# EasyEDA Pro project STM32F767_F429_H743底板原理图_PCB.eprj, schematic 原理图1

## Sheets
1 原理图1
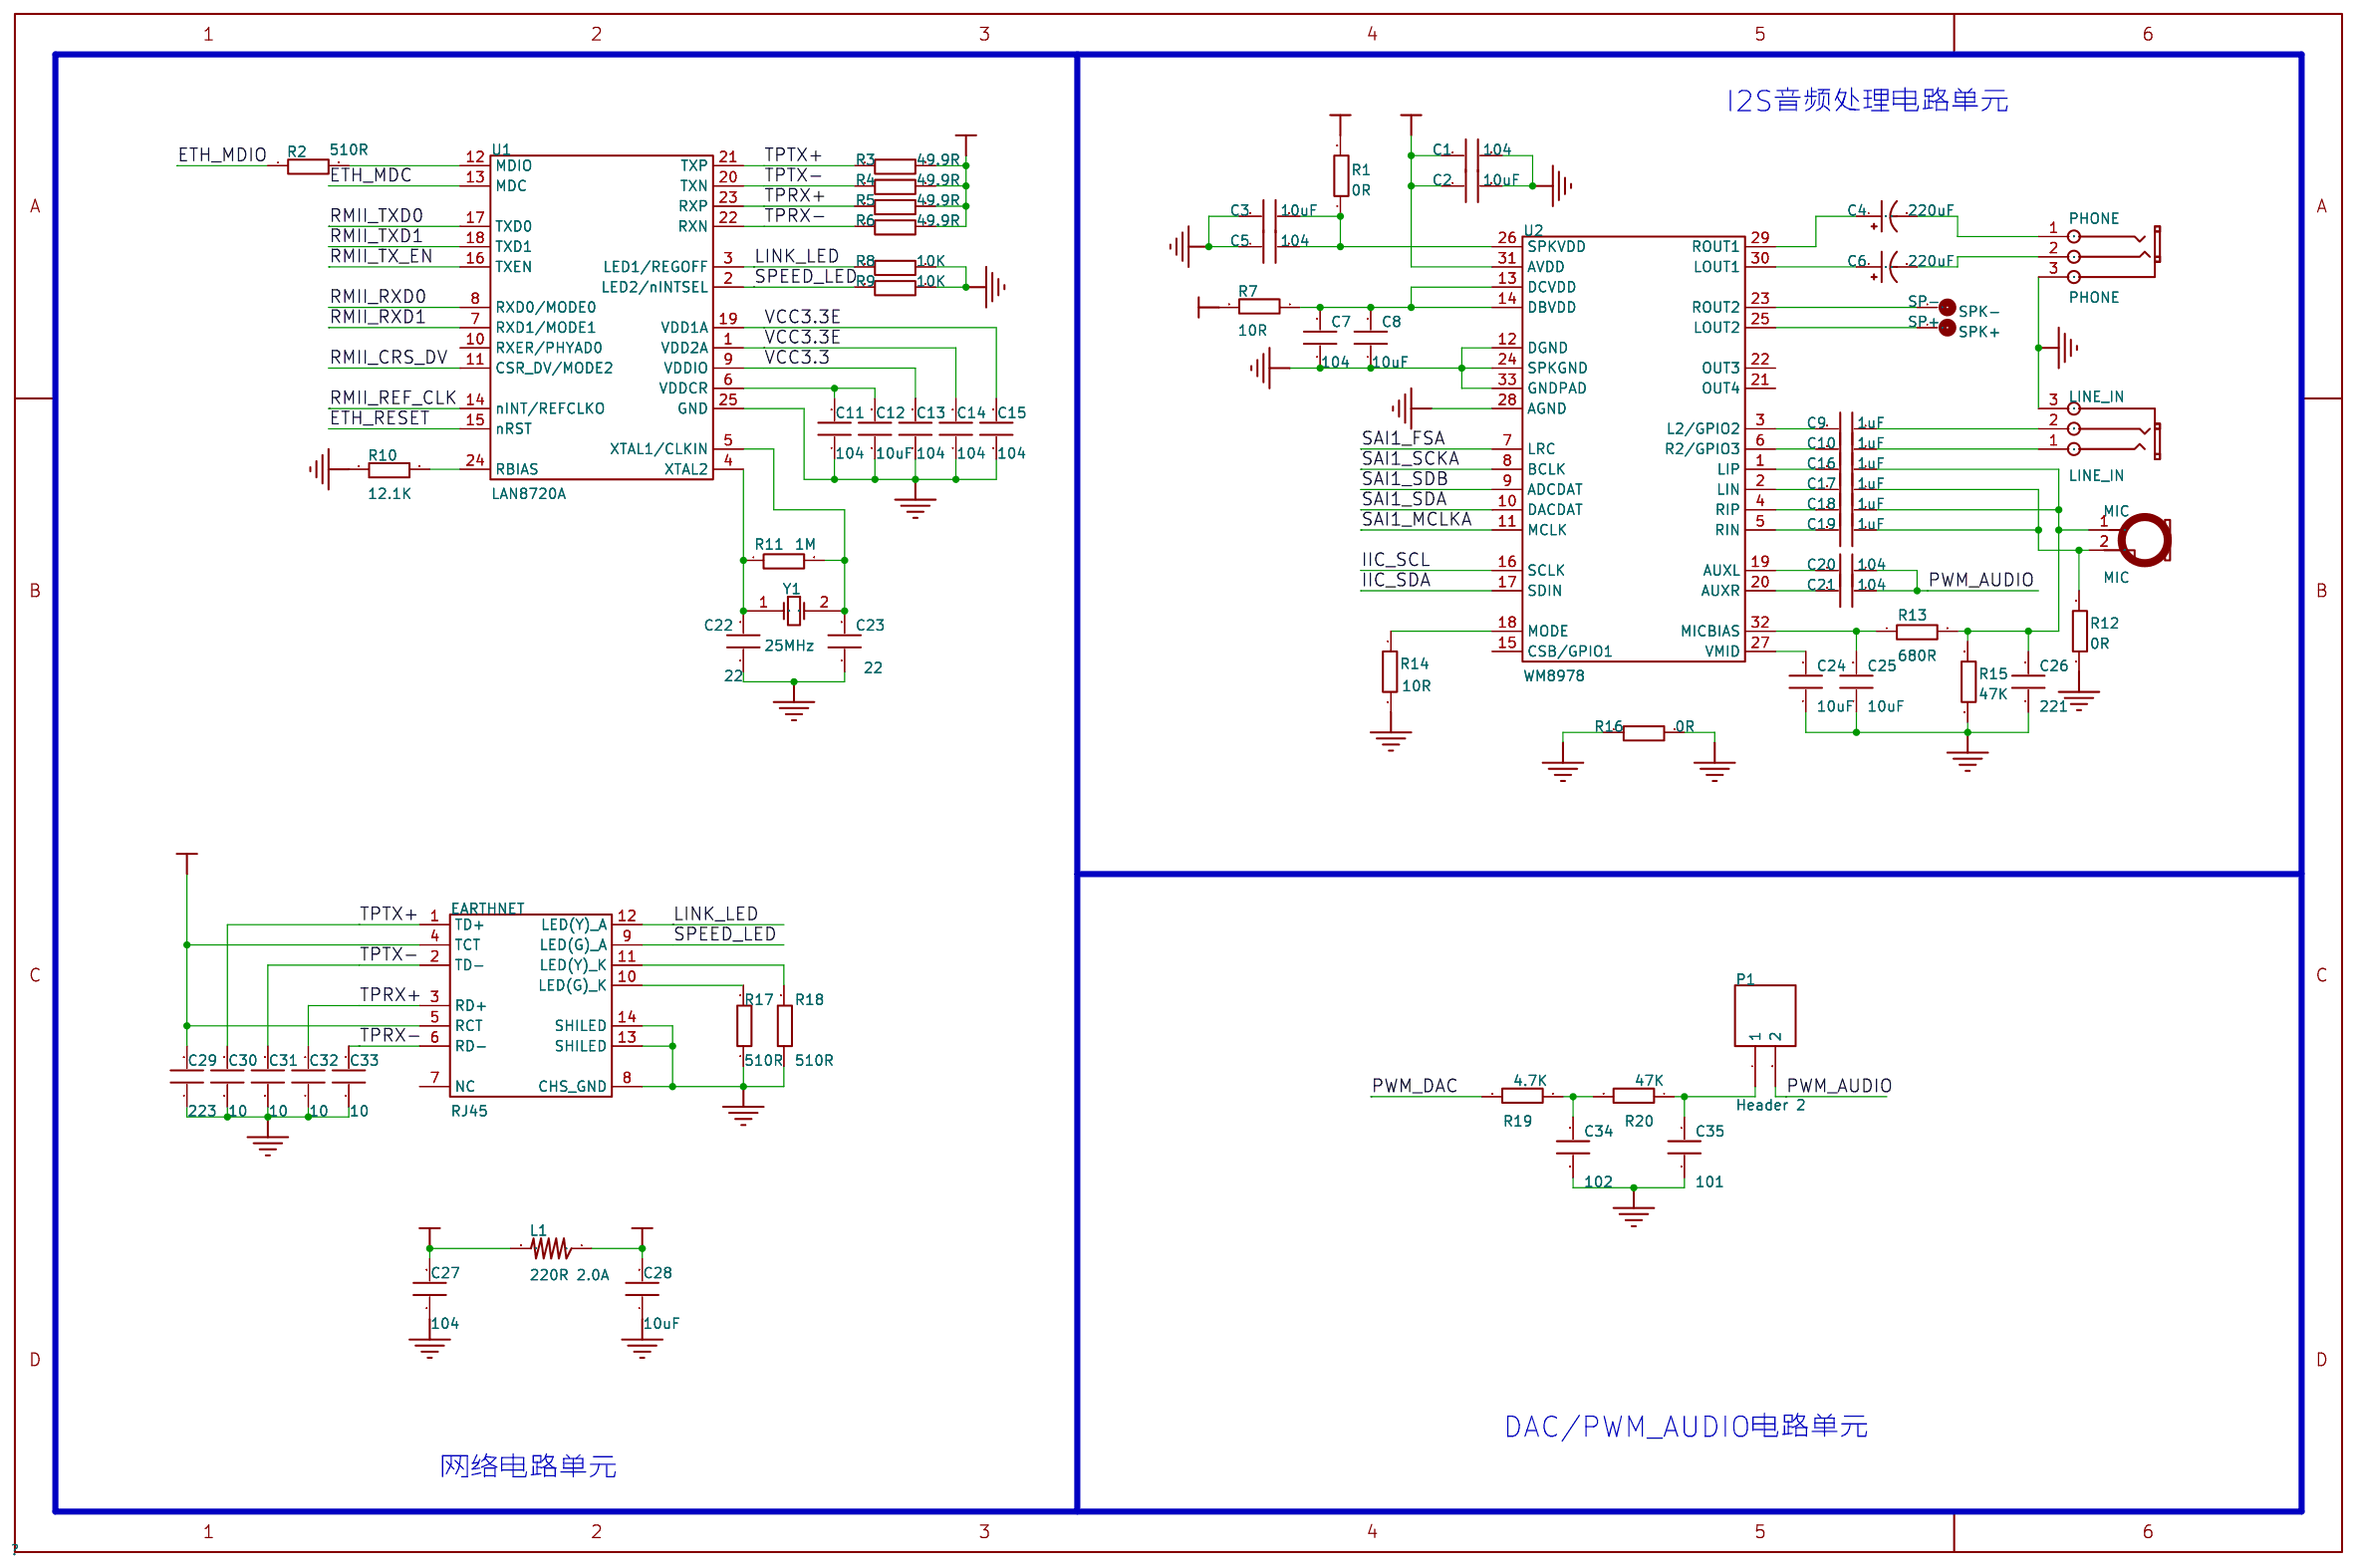
[diagram p0: 原理图1]
2 原理图2
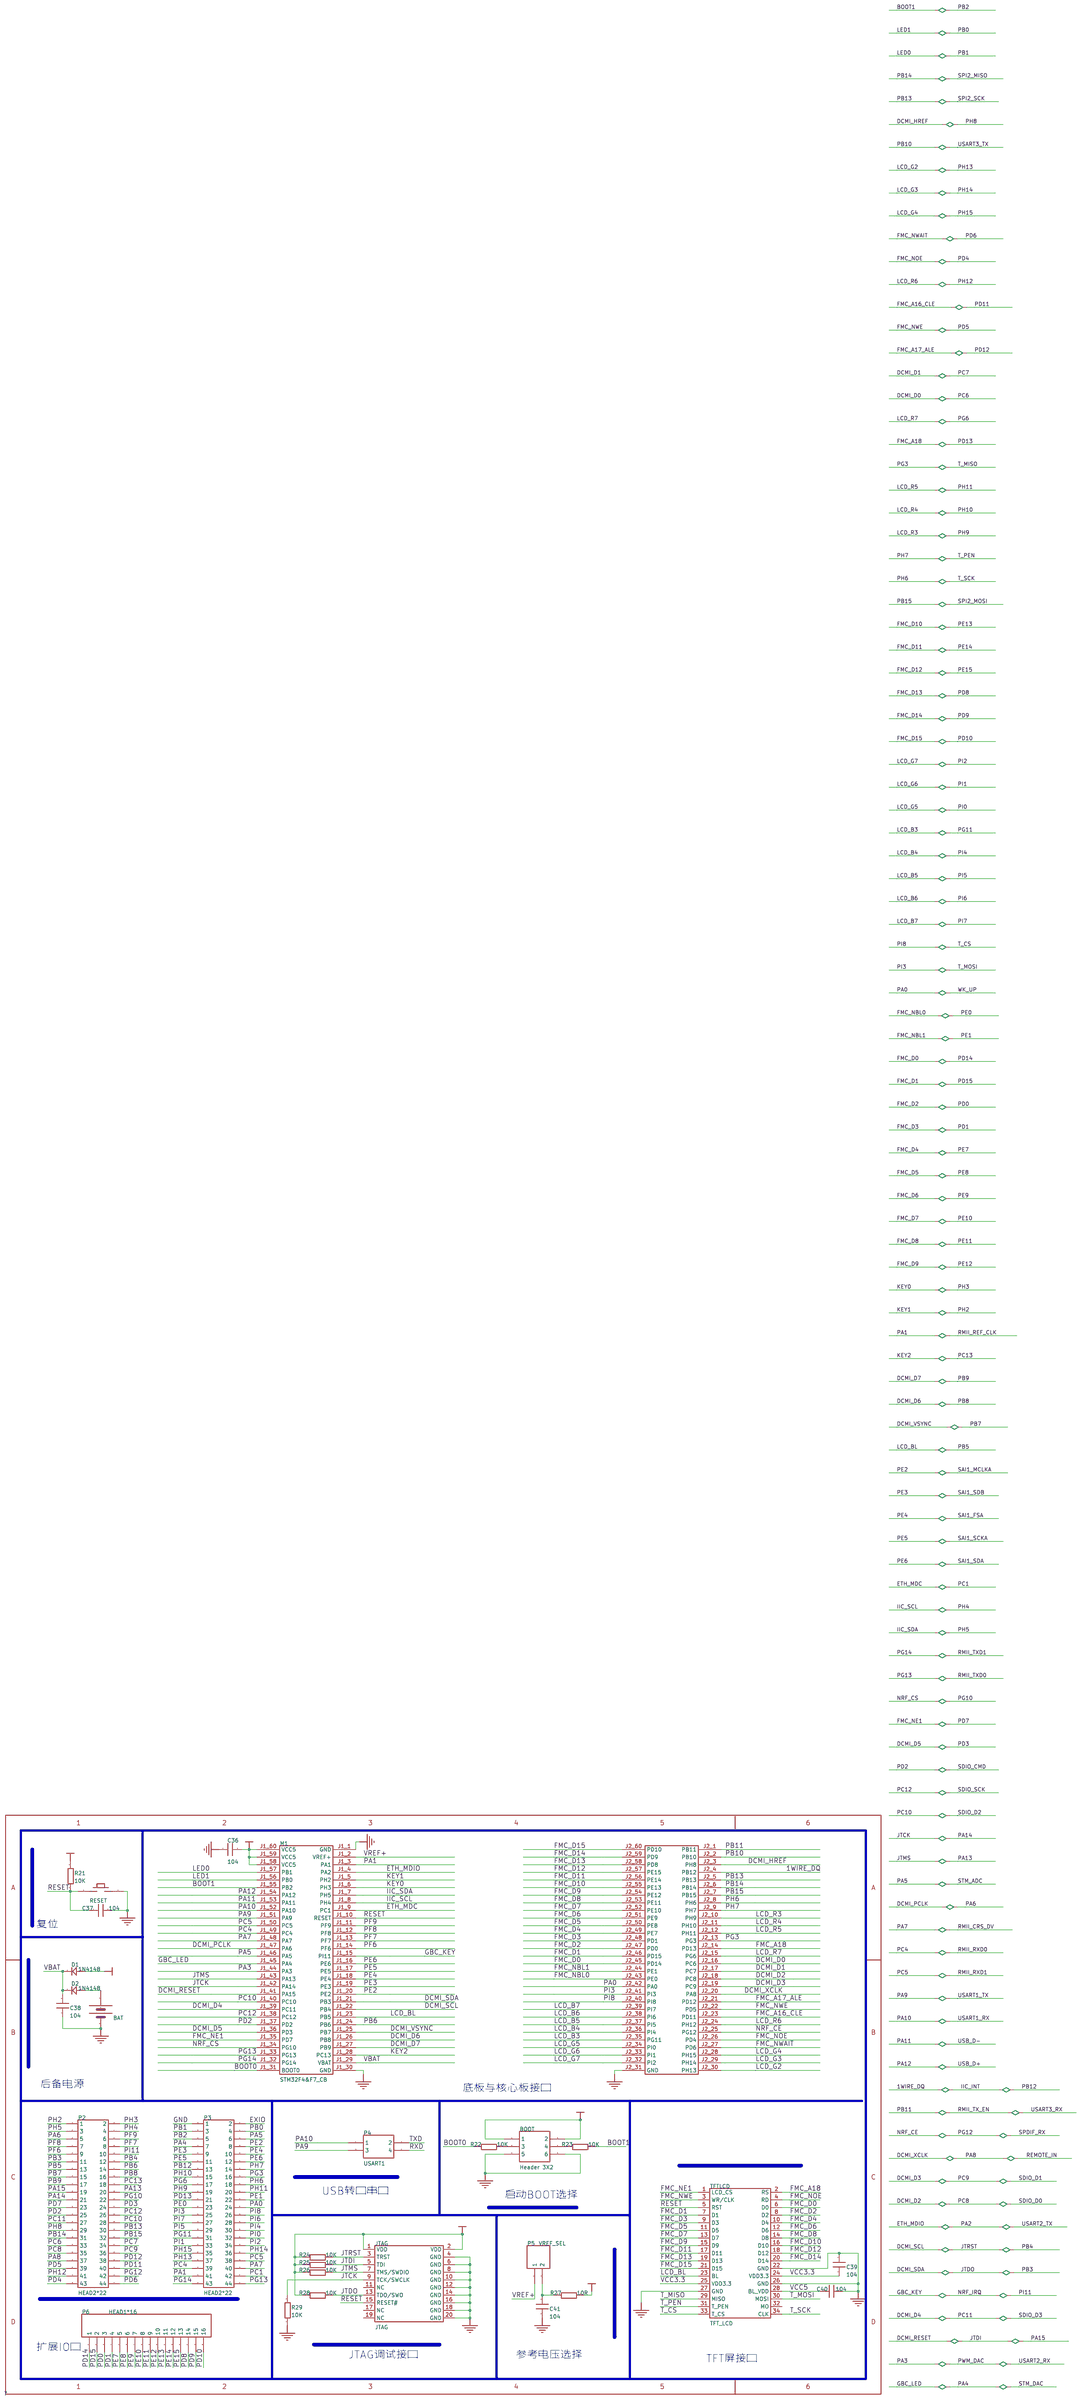
[diagram p1: 原理图2]
3 原理图3
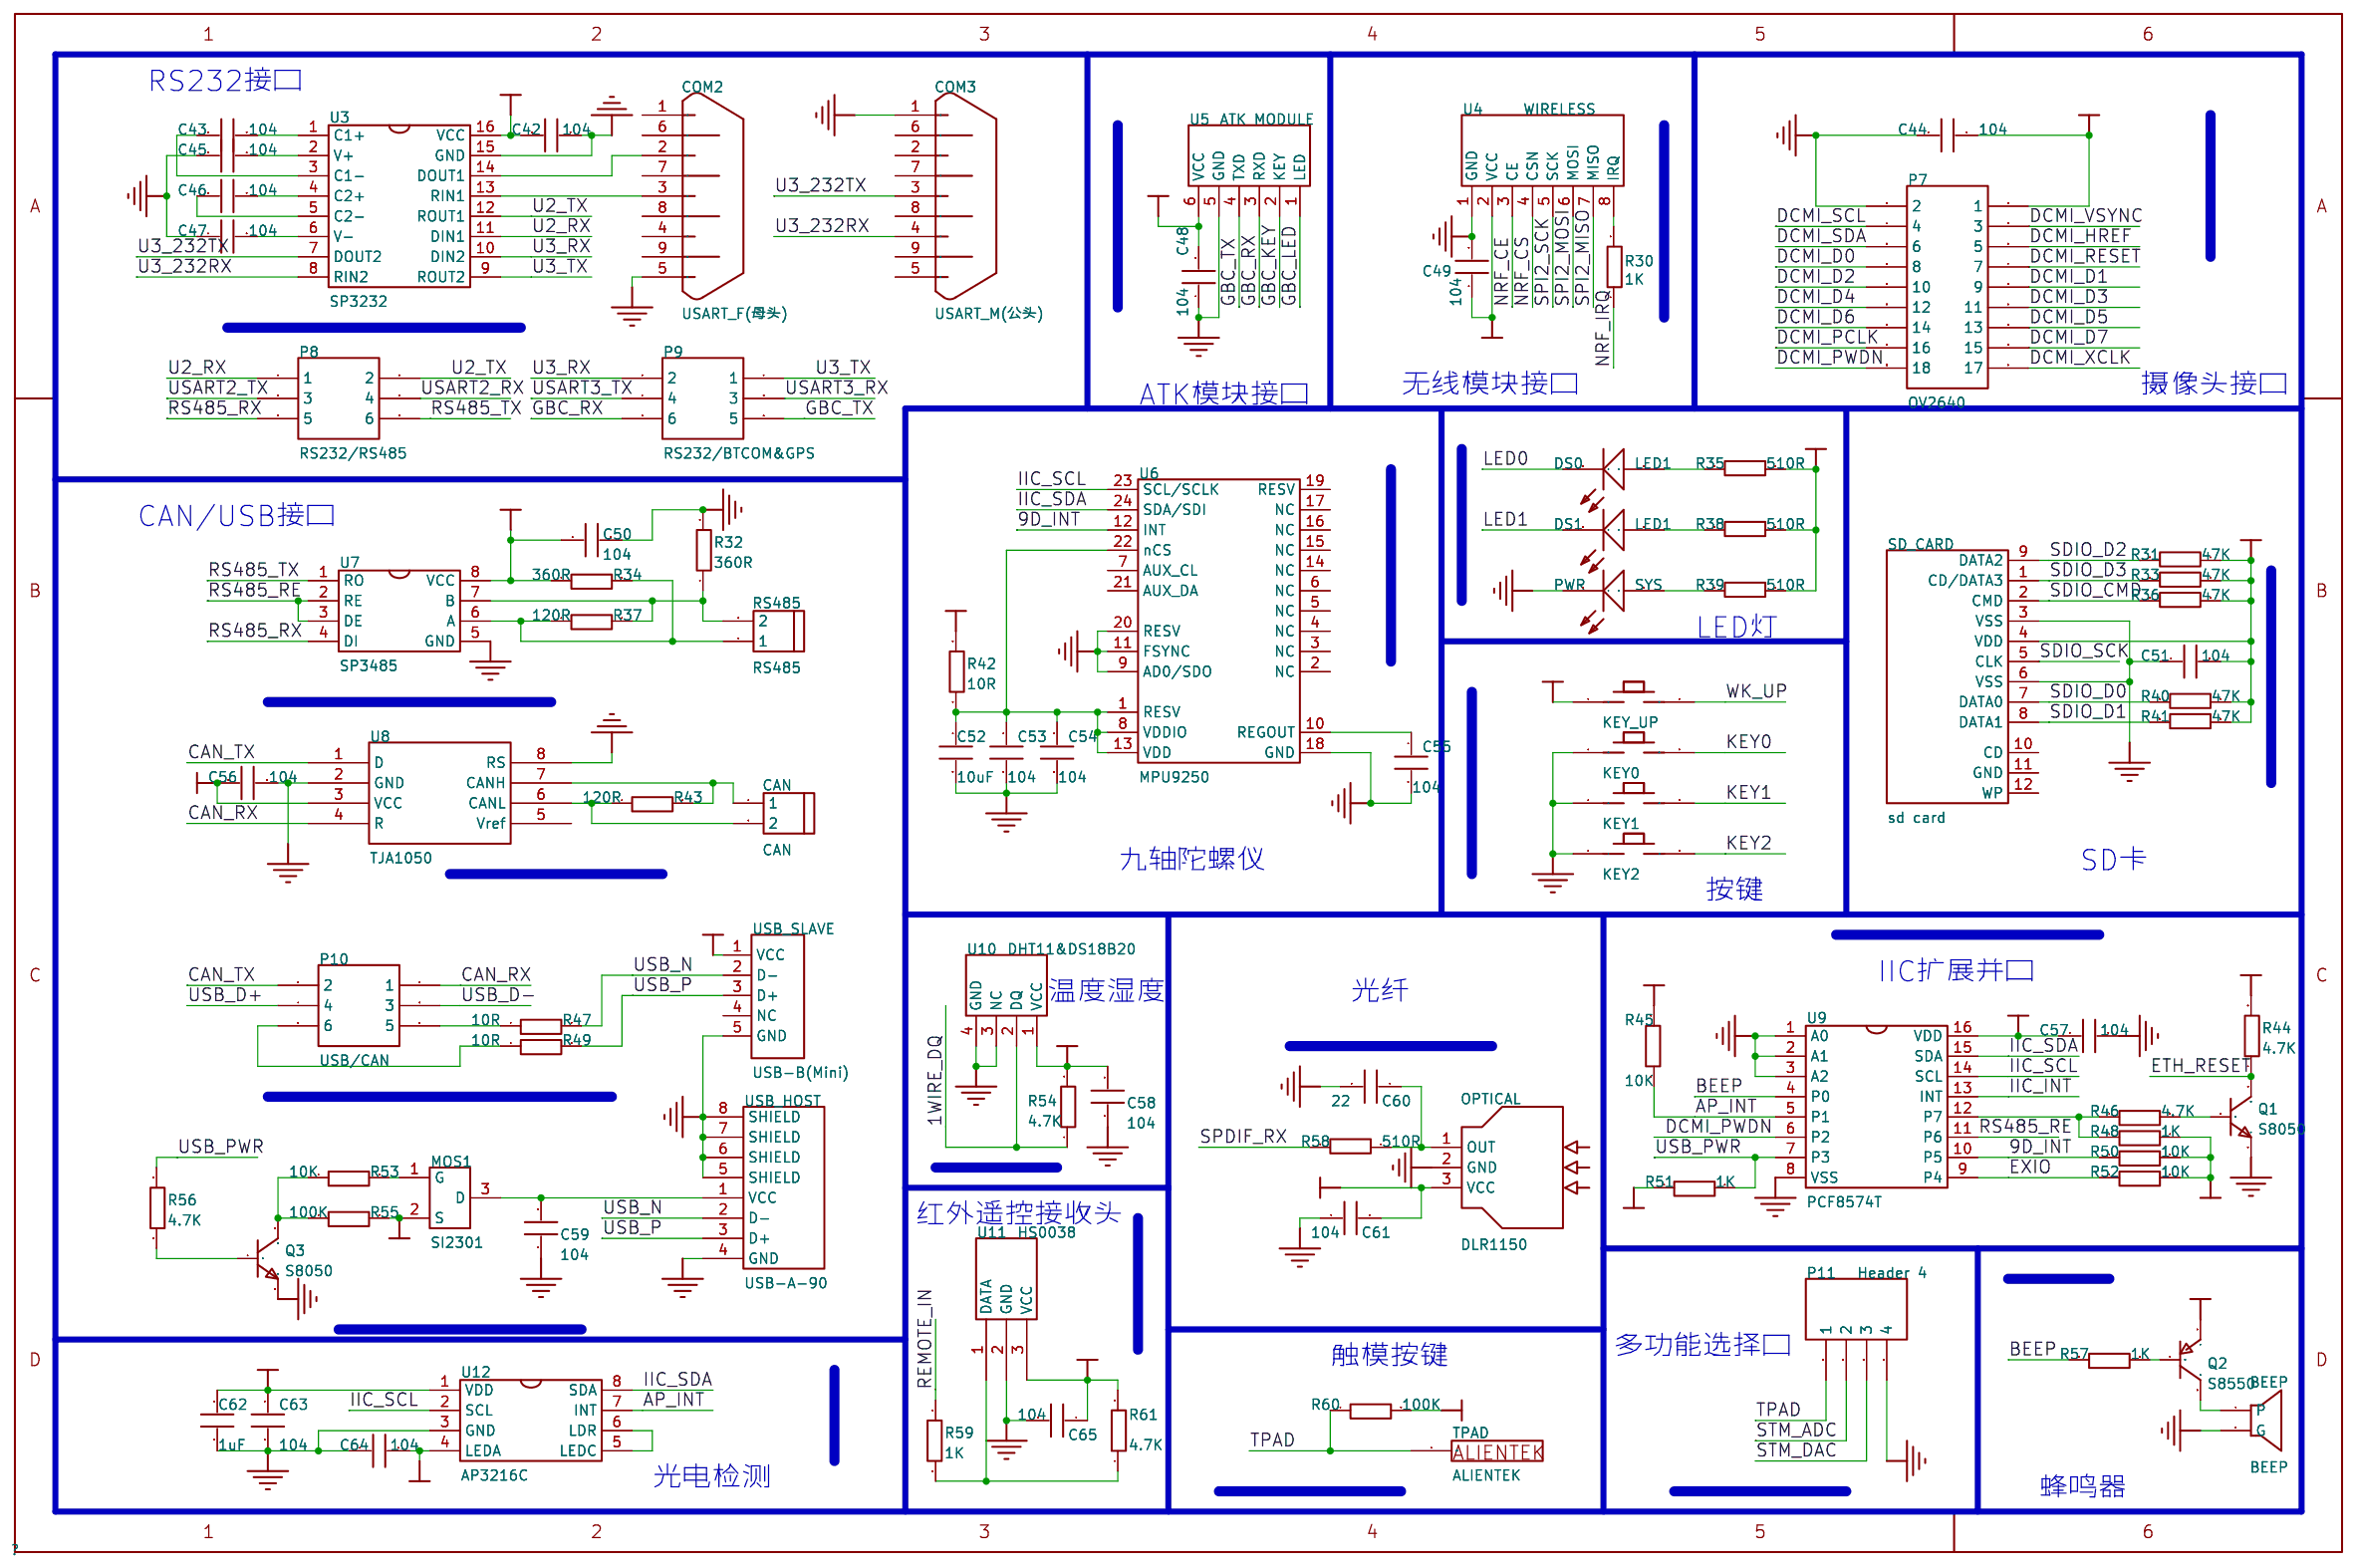
[diagram p2: 原理图3]
4 原理图4
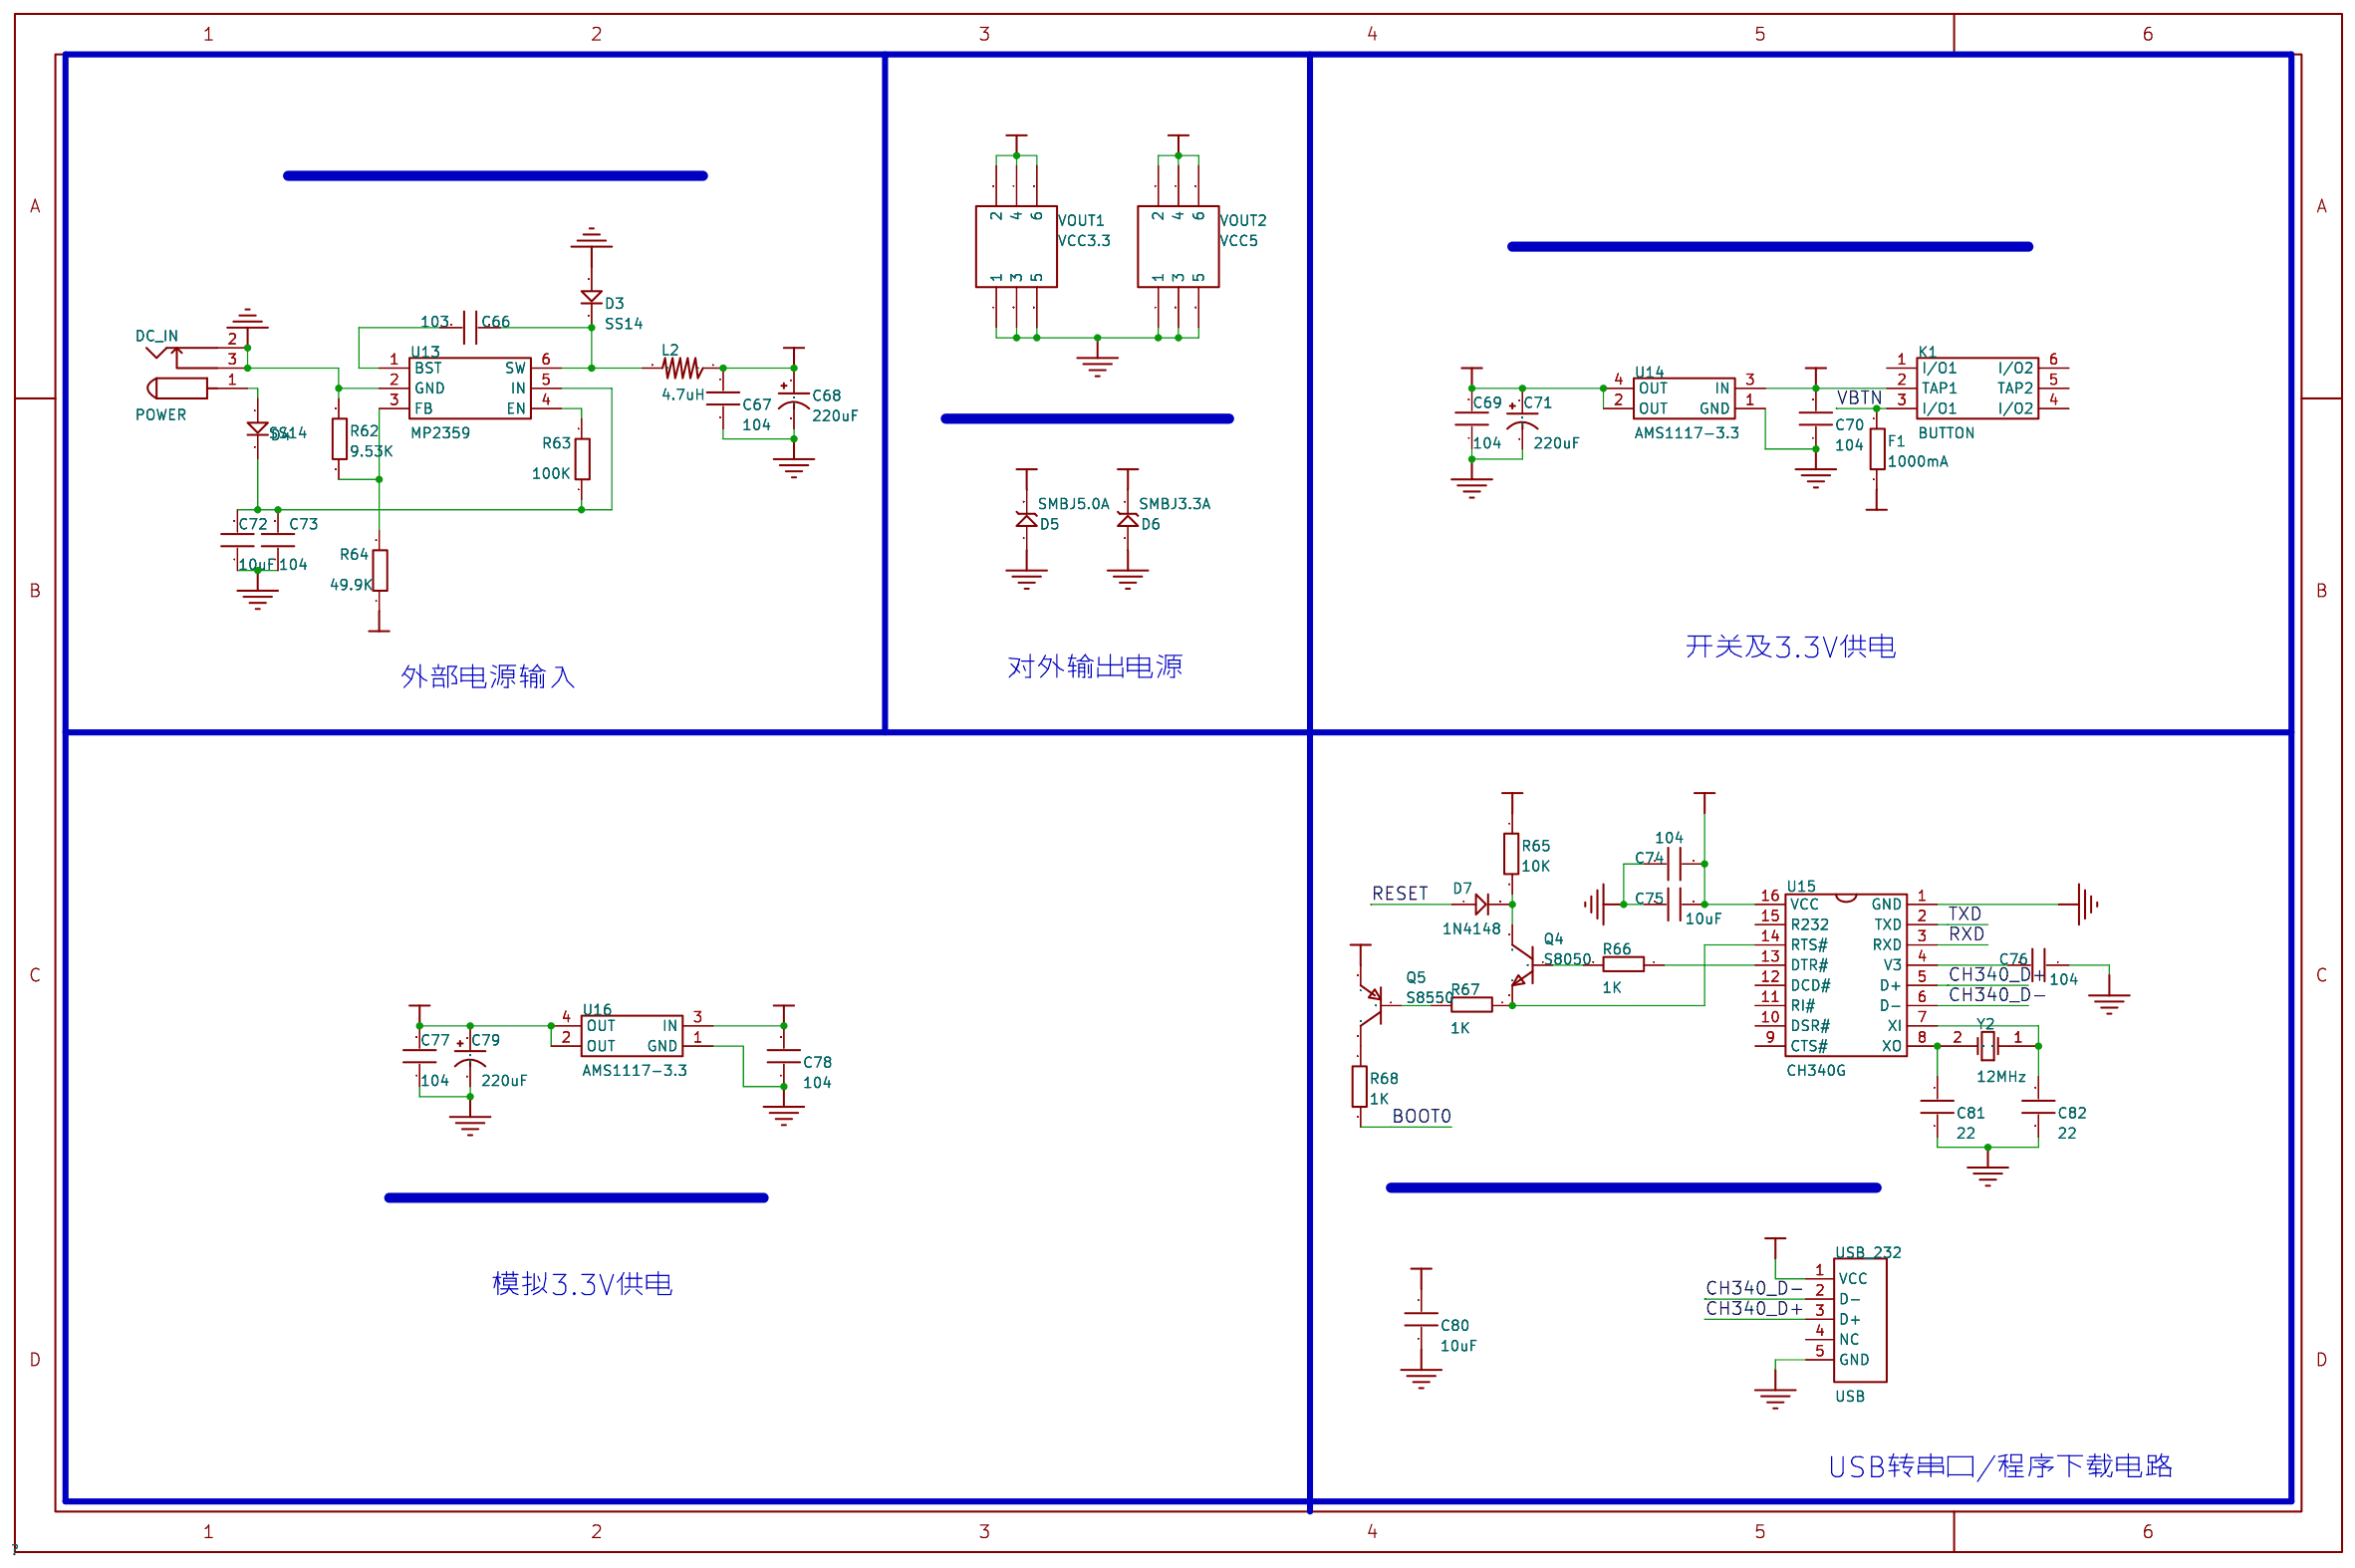
[diagram p3: 原理图4]

## Parts
sheet 原理图1
C1  104  [C 0603]
C2  10uF  [0805]
C3  10uF  [0805]
C4  220uF  [CM D(6.3*7.7)]
C5  104  [C 0603]
C6  220uF  [CM D(6.3*7.7)]
C7  104  [C 0603]
C8  10uF  [0805]
C9  1uF  [C 0603]
C10  1uF  [C 0603]
C11  104  [C 0603]
C12  10uF  [0805]
C13  104  [C 0603]
C14  104  [C 0603]
C15  104  [C 0603]
C16  1uF  [C 0603]
C17  1uF  [C 0603]
C18  1uF  [C 0603]
C19  1uF  [C 0603]
C20  104  [C 0603]
C21  104  [C 0603]
C22  22  [C 0603]
C23  22  [C 0603]
C24  10uF  [0805]
C25  10uF  [0805]
C26  221  [C 0603]
C27  104  [C 0603]
C28  10uF  [0805]
C29  223  [C 0603]
C30  10  [C 0603]
C31  10  [C 0603]
C32  10  [C 0603]
C33  10  [C 0603]
C34  102  [C 0603]
C35  101  [C 0603]
EARTHNET  RJ45  [HR911105A]
L1  220R 2.0A  [L 0603]
LINE_IN  LINE_IN  [PJ-313]
MIC  MIC  [MIC-6022]
P1  Header 2  [HDR1X2]
PHONE  PHONE  [PJ-313]
R1  0R  [R 0603]
R2  510R  [R 0603]
R3  49.9R  [R 0603]
R4  49.9R  [R 0603]
R5  49.9R  [R 0603]
R6  49.9R  [R 0603]
R7  10R  [R 0603]
R8  10K  [R 0603]
R9  10K  [R 0603]
R10  12.1K  [R 0603]
R11  1M  [R 0603]
R12  0R  [R 0603]
R13  680R  [R 0603]
R14  10R  [R 0603]
R15  47K  [R 0603]
R16  0R  [R 0603]
R17  510R  [R 0603]
R18  510R  [R 0603]
R19  4.7K  [R 0603]
R20  47K  [R 0603]
SP+  SPK+  [TP-1.5]
SP-  SPK-  [TP-1.5]
U1  LAN8720A  [QFN24]
U2  WM8978  [QFN32_G]
Y1  25MHz  [OSC HC-49S]
sheet 原理图2
BAT  BATT  [BATM]
BOOT  Header 3X2  [HDR2X3]
C36  104  [C 0603]
C37  104  [C 0603]
C38  104  [C 0603]
C39  104  [C 0603]
C40  104  [C 0603]
C41  104  [C 0603]
D1  1N4148  [DIODE_SOP]
D2  1N4148  [DIODE_SOP]
JTAG  JTAG  [JTAG_20]
M1  STM32F4&F7_CB  [STM32F4&F7_CB]
P2  HEAD2*22  [HDR2.54-LI-2x22P]
P3  HEAD2*22  [HDR2.54-LI-2x22P]
P4  USART1  [HDR2X2]
P5  VREF_SEL  [HDR1X2]
P6  HEAD1*16  [HDR1X16]
R21  10K  [R 0603]
R22  10K  [R 0603]
R23  10K  [R 0603]
R24  10K  [R 0603]
R25  10K  [R 0603]
R26  10K  [R 0603]
R27  10R  [R 0603]
R28  10K  [R 0603]
R29  10K  [R 0603]
RESET  KEY_M  [KEY_M]
TFTLCD  TFT_LCD  [DB2*17-4.3]
sheet 原理图3
BEEP  BEEP  [BELL-5]
C42  104  [C 0603]
C43  104  [C 0603]
C44  104  [C 0603]
C45  104  [C 0603]
C46  104  [C 0603]
C47  104  [C 0603]
C48  104  [C 0603]
C49  104  [C 0603]
C50  104  [C 0603]
C51  104  [C 0603]
C52  10uF  [0805]
C53  104  [C 0603]
C54  104  [C 0603]
C55  104  [C 0603]
C56  104  [C 0603]
C57  104  [C 0603]
C58  104  [C 0603]
C59  104  [C 0603]
C60  22  [C 0603]
C61  104  [C 0603]
C62  1uF  [C 0603]
C63  104  [C 0603]
C64  104  [C 0603]
C65  104  [C 0603]
CAN  CAN  [KF301-5.0-2P]
COM2  USART_F(母头)  [DB9]
COM3  USART_M(公头)  [DB9]
DS0  LED1  [SMDLED]
DS1  LED1  [SMDLED]
KEY0  KEY_M  [KEY_M]
KEY1  KEY_M  [KEY_M]
KEY2  KEY_M  [KEY_M]
KEY_UP  KEY_M  [KEY_M]
MOS1  SI2301  [SOT-23A]
OPTICAL  DLR1150  [DLR-1150 / 2150]
P7  OV2640  [HDR2X9]
P8  RS232/RS485  [HDR2X3]
P9  RS232/BTCOM&GPS  [HDR2X3]
P10  USB/CAN  [HDR2X3]
P11  Header 4  [HDR1X4]
PWR  SYS  [SMDLED]
Q1  S8050  [SOT-23A]
Q2  S8550  [SOT-23A]
Q3  S8050  [SOT-23A]
R30  1K  [R 0603]
R31  47K  [R 0603]
R32  360R  [R 0603]
R33  47K  [R 0603]
R34  360R  [R 0603]
R35  510R  [R 0603]
R36  47K  [R 0603]
R37  120R  [R 0603]
R38  510R  [R 0603]
R39  510R  [R 0603]
R40  47K  [R 0603]
R41  47K  [R 0603]
R42  10R  [R 0603]
R43  120R  [R 0603]
R44  4.7K  [R 0603]
R45  10K  [R 0603]
R46  4.7K  [R 0603]
R47  10R  [R 0603]
R48  1K  [R 0603]
R49  10R  [R 0603]
R50  10K  [R 0603]
R51  1K  [R 0603]
R52  10K  [R 0603]
R53  10K  [R 0603]
R54  4.7K  [R 0603]
R55  100K  [R 0603]
R56  4.7K  [R 0603]
R57  1K  [R 0603]
R58  510R  [R 0603]
R59  1K  [R 0603]
R60  100K  [R 0603]
R61  4.7K  [R 0603]
RS485  RS485  [KF301-5.0-2P]
SD_CARD  sd card  [SDCARD_L]
TPAD  ALIENTEK  [ALIENTEK_PAD1]
U3  SP3232  [SOP16M]
U4  WIRELESS  [NRF24L01]
U5  ATK MODULE  [HEAD6]
U6  MPU9250  [QFN24-T]
U7  SP3485  [SOP-8]
U8  TJA1050  [SOP-8]
U9  PCF8574T  [SO-16]
U10  DHT11&DS18B20  [DHT11]
U11  HS0038  [VS1838B-A]
U12  AP3216C  [AP3216C]
USB_HOST  USB-A-90  [USB-A-90]
USB_SLAVE  USB-B(Mini)  [USB/SM0.8-6H5]
sheet 原理图4
C66  103  [C 0603]
C67  104  [C 0603]
C68  220uF  [CM D(6.3*7.7)]
C69  104  [C 0603]
C70  104  [C 0603]
C71  220uF  [CM D(6.3*7.7)]
C72  10uF  [0805]
C73  104  [C 0603]
C74  104  [C 0603]
C75  10uF  [0805]
C76  104  [C 0603]
C77  104  [C 0603]
C78  104  [C 0603]
C79  220uF  [CM D(6.3*7.7)]
C80  10uF  [0805]
C81  22  [C 0603]
C82  22  [C 0603]
D3  SS14  [DO-214AC]
D4  SS14  [DO-214AC]
D5  SMBJ5.0A  [SMBJ]
D6  SMBJ3.3A  [SMBJ]
D7  1N4148  [DIODE_SOP]
DC_IN  POWER  [DC-005]
F1  1000mA  [FU 1206]
K1  BUTTON  [KFT DIP-8.5*8.5]
L2  4.7uH  [CDRH73]
Q4  S8050  [SOT-23A]
Q5  S8550  [SOT-23A]
R62  9.53K  [R 0603]
R63  100K  [R 0603]
R64  49.9K  [R 0603]
R65  10K  [R 0603]
R66  1K  [R 0603]
R67  1K  [R 0603]
R68  1K  [R 0603]
U13  MP2359  [SOT-23-6]
U14  AMS1117-3.3  [SOT223_N_A]
U15  CH340G  [SOP16M]
U16  AMS1117-3.3  [SOT223_N_A]
USB_232  USB  [USB/SM0.8-6H5]
VOUT1  VCC3.3  [HDR2X3]
VOUT2  VCC5  [HDR2X3]
Y2  12MHz  [OSC HC-49S]

## Library data of the parts
C1 C5 C7 C11 C13-C15 C20 C21 C27 C36-C51 C53-C59 C61 C63-C65 C67 C69 C70 C73 C74 C76-C78 = 104: Design Item ID: C; Library Name: STM32F429_F746
C2 C3 C8 C12 C24 C25 C28 C52 C72 C75 C80 = 10uF: Design Item ID: C; Library Name: STM32F429_F746
C4 C6 C68 C71 C79 = 220uF: Design Item ID: CAP; Library Name: STM32F429_F746
C9 C10 C16-C19 C62 = 1uF: Design Item ID: C; Library Name: STM32F429_F746
C22 C23 C60 C81 C82 = 22: Design Item ID: C; Library Name: STM32F429_F746
C26 = 221: Design Item ID: C; Library Name: STM32F429_F746
C29 = 223: Design Item ID: C; Library Name: STM32F429_F746
C30-C33 = 10: Design Item ID: C; Library Name: STM32F429_F746
C34 = 102: Design Item ID: C; Library Name: STM32F429_F746
C35 = 101: Design Item ID: C; Library Name: STM32F429_F746
EARTHNET = RJ45: Design Item ID: HR911105; Library Name: STM32F429_F746
L1 = 220R 2.0A: Design Item ID: L_SOP; Library Name: STM32F429_F746
LINE_IN = LINE_IN: Design Item ID: PHONE_M; Library Name: STM32F429_F746
MIC = MIC: Library Name: STM32F429_F746
P1 = Header 2: Header, 2-Pin; LatestRevisionDate: 17-Jul-2002; LatestRevisionNote: Re-released for DXP Platform.; Publisher: Altium Limited; Library Name: STM32F429_F746
PHONE = PHONE: Design Item ID: PHONE_M; Library Name: STM32F429_F746
R1 R12 R16 = 0R: Design Item ID: R; Library Name: STM32F429_F746
R2 R17 R18 R35 R38 R39 R58 = 510R: Design Item ID: R; Library Name: STM32F429_F746
R3-R6 = 49.9R: Design Item ID: R; Library Name: STM32F429_F746
R7 R14 R27 R42 R47 R49 = 10R: Design Item ID: R; Library Name: STM32F429_F746
R8 R9 R21-R26 R28 R29 R45 R50 R52 R53 R65 = 10K: Design Item ID: R; Library Name: STM32F429_F746
R10 = 12.1K: Design Item ID: R; Library Name: STM32F429_F746
R11 = 1M: Design Item ID: R; Library Name: STM32F429_F746
R13 = 680R: Design Item ID: R; Library Name: STM32F429_F746
R15 R20 R31 R33 R36 R40 R41 = 47K: Design Item ID: R; Library Name: STM32F429_F746
R19 R44 R46 R54 R56 R61 = 4.7K: Design Item ID: R; Library Name: STM32F429_F746
SP+ = SPK+: 测试点; Design Item ID: TEST-POINT; Library Name: STM32F429_F746
SP- = SPK-: 测试点; Design Item ID: TEST-POINT; Library Name: STM32F429_F746
U1 = LAN8720A: ETH PHY; Design Item ID: LAN8720; Library Name: STM32F429_F746
U2 = WM8978: 24bit ADC&DAC; Library Name: STM32F429_F746
Y1 = 25MHz: Crystal Oscillator; Published: 8-Jun-2000; LatestRevisionDate: 17-Jul-2002; LatestRevisionNote: Re-released for DXP Platform.; Publisher: Altium Limited; Design Item ID: XTAL; Library Name: STM32F429_F746
BAT = BATT: Library Name: STM32F429_F746
BOOT = Header 3X2: Header, 3-Pin, Dual row; LatestRevisionDate: 17-Jul-2002; LatestRevisionNote: Re-released for DXP Platform.; Publisher: Altium Limited; Library Name: STM32F429_F746
D1 D2 D7 = 1N4148: Design Item ID: D; Library Name: STM32F429_F746
JTAG = JTAG: Library Name: STM32F429_F746
M1 = STM32F4&F7_CB: F429/746 Core Board; Library Name: STM32F429_F746
P2 P3 = HEAD2*22: Library Name: STM32F429_F746
P4 = USART1: Header, 2-Pin, Dual row; LatestRevisionDate: 17-Jul-2002; LatestRevisionNote: Re-released for DXP Platform.; Publisher: Altium Limited; Design Item ID: Header 2X2; Library Name: STM32F429_F746
P5 = VREF_SEL: Header, 2-Pin; LatestRevisionDate: 17-Jul-2002; LatestRevisionNote: Re-released for DXP Platform.; Publisher: Altium Limited; Design Item ID: Header 2; Library Name: STM32F429_F746
P6 = HEAD1*16: Header, 16-Pin; LatestRevisionDate: 17-Jul-2002; LatestRevisionNote: Re-released for DXP Platform.; Publisher: Altium Limited; Design Item ID: Header 16; Library Name: STM32F429_F746
KEY0-KEY2 KEY_UP RESET = KEY_M: Library Name: STM32F429_F746
TFTLCD = TFT_LCD: Library Name: STM32F429_F746
BEEP = BEEP: Library Name: STM32F429_F746
CAN = CAN: Design Item ID: HEAD2; Library Name: STM32F429_F746
COM2 = USART_F(母头): Library Name: STM32F429_F746
COM3 = USART_M(公头): Library Name: STM32F429_F746
DS0 DS1 = LED1: Typical RED, GREEN, YELLOW, AMBER GaAs LED; Published: 8-Jun-2000; LatestRevisionDate: 17-Jul-2002; LatestRevisionNote: Re-released for DXP Platform.; PackageDocument: Feb-2002; PackageReference: 3.2X1.6X1.1; Publisher: Altium Limited; Design Item ID: LED2; Library Name: STM32F429_F746
MOS1 = SI2301: IRLML6401/SI2301; Design Item ID: MOS-P; Library Name: STM32F429_F746
OPTICAL = DLR1150: 音频光纤接收座; Design Item ID: DLR 1150/2150; Library Name: STM32F429_F746
P7 = OV2640: Header, 9-Pin, Dual row; LatestRevisionDate: 17-Jul-2002; LatestRevisionNote: Re-released for DXP Platform.; Publisher: Altium Limited; Design Item ID: Header 9X2; Library Name: STM32F429_F746
P8 = RS232/RS485: Header, 3-Pin, Dual row; LatestRevisionDate: 17-Jul-2002; LatestRevisionNote: Re-released for DXP Platform.; Publisher: Altium Limited; Design Item ID: Header 3X2; Library Name: STM32F429_F746
P9 = RS232/BTCOM&GPS: Header, 3-Pin, Dual row; LatestRevisionDate: 17-Jul-2002; LatestRevisionNote: Re-released for DXP Platform.; Publisher: Altium Limited; Design Item ID: Header 3X2; Library Name: STM32F429_F746
P10 = USB/CAN: Header, 3-Pin, Dual row; LatestRevisionDate: 17-Jul-2002; LatestRevisionNote: Re-released for DXP Platform.; Publisher: Altium Limited; Design Item ID: Header 3X2; Library Name: STM32F429_F746
P11 = Header 4: Header, 4-Pin; LatestRevisionDate: 17-Jul-2002; LatestRevisionNote: Re-released for DXP Platform.; Publisher: Altium Limited; Library Name: STM32F429_F746
PWR = SYS: Typical RED, GREEN, YELLOW, AMBER GaAs LED; Published: 8-Jun-2000; LatestRevisionDate: 17-Jul-2002; LatestRevisionNote: Re-released for DXP Platform.; PackageDocument: Feb-2002; PackageReference: 3.2X1.6X1.1; Publisher: Altium Limited; Design Item ID: LED2; Library Name: STM32F429_F746
Q1 Q3 Q4 = S8050: NPN Bipolar Transistor; Published: 8-Jun-2000; LatestRevisionDate: 17-Jul-2002; LatestRevisionNote: Re-released for DXP Platform.; PackageReference: TO-226-AA; Publisher: Altium Limited; PackageDescription: TO, Flat Index; 3 In-Line, Axial Leads; Body Dia. 4.8mm; Leads 0.55 x 0.51 mm (max); Code_JEDEC: TO-226-AA; Design Item ID: NPN; Library Name: Miscellaneous Devices
Q2 Q5 = S8550: PNP Bipolar Transistor; Published: *; LatestRevisionDate: *; LatestRevisionNote: *; PackageReference: *; Publisher: *; Code_JEDEC: *; Design Item ID: PNP; Library Name: dam_1
R30 R48 R51 R57 R59 R66-R68 = 1K: Design Item ID: R; Library Name: STM32F429_F746
R32 R34 = 360R: Design Item ID: R; Library Name: STM32F429_F746
R37 R43 = 120R: Design Item ID: R; Library Name: STM32F429_F746
R55 R60 R63 = 100K: Design Item ID: R; Library Name: STM32F429_F746
RS485 = RS485: Design Item ID: HEAD2; Library Name: STM32F429_F746
SD_CARD = sd card: Origin Footprint 2: SDCARD_S; Library Name: STM32F429_F746
TPAD = ALIENTEK: ALIENTEK TPAD; Library Name: STM32F429_F746
U3 = SP3232: Design Item ID: MAX3232; Library Name: STM32F429_F746
U4 = WIRELESS: Library Name: STM32F429_F746
U5 = ATK MODULE: ATK-HC05; Design Item ID: ATK-HC05; Library Name: STM32F429_F746
U6 = MPU9250: 9轴运动处理传感器; Library Name: STM32F429_F746
U7 = SP3485: Design Item ID: MAX3485; Library Name: STM32F429_F746
U8 = TJA1050: Design Item ID: SN65HVD230D; Library Name: STM32F429_F746
U9 = PCF8574T: 8路IO扩展,IIC接口; Library Name: STM32F429_F746
U10 = DHT11&DS18B20: 数字温湿度传感器; Library Name: STM32F429_F746
U11 = HS0038: Library Name: STM32F429_F746
U12 = AP3216C: ALS+PS Sensor; Library Name: STM32F429_F746
USB_HOST = USB-A-90: Design Item ID: USB_A_90; Library Name: STM32F429_F746
USB_SLAVE = USB-B(Mini): Design Item ID: USB5; Library Name: STM32F429_F746
C66 = 103: Design Item ID: C; Library Name: STM32F429_F746
D3 D4 = SS14: Design Item ID: D; Library Name: STM32F429_F746
D5 = SMBJ5.0A: TVS; Library Name: STM32F429_F746
D6 = SMBJ3.3A: TVS; Library Name: STM32F429_F746
DC_IN = POWER: Design Item ID: POW; Library Name: STM32F429_F746
F1 = 1000mA: Design Item ID: R; Library Name: STM32F429_F746
K1 = BUTTON: Library Name: STM32F429_F746
L2 = 4.7uH: Design Item ID: L_SOP; Library Name: STM32F429_F746
R62 = 9.53K: Design Item ID: R; Library Name: STM32F429_F746
R64 = 49.9K: Design Item ID: R; Library Name: STM32F429_F746
U13 = MP2359: DC DC Step Down IC; Library Name: STM32F429_F746
U14 U16 = AMS1117-3.3: Design Item ID: AMS1117; Library Name: STM32F429_F746
U15 = CH340G: USB2UART; Library Name: STM32F429_F746
USB_232 = USB: Design Item ID: USB5; Library Name: STM32F429_F746
VOUT1 = VCC3.3: Header, 3-Pin, Dual row; LatestRevisionDate: 17-Jul-2002; LatestRevisionNote: Re-released for DXP Platform.; Publisher: Altium Limited; Design Item ID: Header 3X2; Library Name: STM32F429_F746
VOUT2 = VCC5: Header, 3-Pin, Dual row; LatestRevisionDate: 17-Jul-2002; LatestRevisionNote: Re-released for DXP Platform.; Publisher: Altium Limited; Design Item ID: Header 3X2; Library Name: STM32F429_F746
Y2 = 12MHz: Crystal Oscillator; Published: 8-Jun-2000; LatestRevisionDate: 17-Jul-2002; LatestRevisionNote: Re-released for DXP Platform.; Publisher: Altium Limited; Design Item ID: XTAL; Library Name: STM32F429_F746

## Nets
AGND: C1.2 C2.2 C24.1 C25.1 C26.1 LINE_IN.3(COM) PHONE.3(COM) R12.1 R15.1 R16.2 U2.28(AGND)
GND: BAT.2(GND) BEEP.2(G) BOOT.5 BOOT.6 C3.1 C5.1 C7.1 C8.1 C11.1 C12.1 C13.1 C14.1 C15.1 C22.1 C23.1 C27.1 C28.1 C29.1 C30.1 C31.1 C32.1 C33.1 C34.1 C35.1 C36.1 C37.2 C38.1 C39.2 C40.1 C41.1 C42.2 C44.2 C45.1 C47.1 C48.1 C49.2 C50.1 C51.1 C52.2 C53.2 C54.2 C55.2 C56.2 C57.2 C58.1 C59.1 C60.2 C61.2 C62.1 C63.1 C64.2 C65.2 C67.2 C68.2(GND) C69.1 C70.1 C71.2(GND) C72.1 C73.1 C74.2 C75.2 C76.1 C77.1 C78.1 C79.2(GND) C80.2 C81.2 C82.2 COM2.5 COM3.1 D3.1 D5.1 D6.1 DC_IN.2 DC_IN.3 EARTHNET.8(CHS GND) EARTHNET.13(SHILED) EARTHNET.14(SHILED) JTAG.4(GND) JTAG.6(GND) JTAG.8(GND) JTAG.10(GND) JTAG.12(GND) JTAG.14(GND) JTAG.16(GND) JTAG.18(GND) JTAG.20(GND) KEY0.1 KEY1.1 KEY2.1 M1.J1_1(GND) M1.J1_30(GND) M1.J2_31(GND) OPTICAL.2(GND) P3.1 P7.2 P11.4 PWR.2(K) Q1.2(E) Q3.2(E) R8.2 R9.2 R10.1 R14.2 R16.1 R17.1 R18.1 R29.1 R32.2 R62.2 RESET.2 SD_CARD.3(VSS) SD_CARD.6(VSS) TFTLCD.22(GND) TFTLCD.26(GND) TFTLCD.27(GND) U1.25(GND) U2.12(DGND) U2.24(SPKGND) U2.33(GNDPAD) U3.15(GND) U4.1(GND) U5.5(GND) U6.9(AD0/SDO) U6.11(FSYNC) U6.18(GND) U6.20(RESV) U7.5(GND) U8.2(GND) U8.8(RS) U9.1(A0) U9.2(A1) U9.3(A2) U9.8(VSS) U10.3(NC) U10.4(GND) U11.2(GND) U12.3(GND) U13.2(GND) U14.1(GND) U15.1(GND) U16.1(GND) USB_232.5(GND) USB_HOST.4(GND) USB_HOST.5(SHIELD) USB_HOST.6(SHIELD) USB_HOST.7(SHIELD) USB_HOST.8(SHIELD) USB_SLAVE.5(GND) VOUT1.1 VOUT1.3 VOUT1.5 VOUT2.1 VOUT2.3 VOUT2.5
VBAT: C38.2 D1.2 D2.2 M1.J1_29(VBAT)
VCC3.3: BOOT.1 BOOT.2 C13.2 C27.2 C39.1 C42.1 C44.1 C49.1 C50.2 C51.2 C57.1 C58.2 C61.1 C62.2 C63.2 C64.1 C65.1 C69.2 C71.1(VCC) D1.1 D6.2 JTAG.1(VDD) JTAG.2(VDD) KEY_UP.1 L1.2 OPTICAL.3(VCC) P7.1 Q2.2(E) Q5.2(E) R7.2 R21.2 R24.1 R25.1 R26.1 R27.2 R28.1 R31.1 R33.1 R34.1 R35.1 R36.1 R38.1 R39.1 R40.1 R41.1 R42.2 R44.2 R45.1 R48.2 R50.2 R51.1 R52.2 R54.2 R60.2 R61.2 R65.1 SD_CARD.4(VDD) TFTLCD.24(VDD3.3) TFTLCD.25(VDD3.3) U1.9(VDDIO) U3.16(VCC) U4.2(VCC) U7.8(VCC) U9.16(VDD) U10.1(VCC) U11.3(VCC) U12.1(VDD) U12.4(LEDA) U14.2(OUT) U14.4(OUT) VOUT1.2 VOUT1.4 VOUT1.6
VCC3.3A: C1.1 C2.1 C77.2 C79.1(VCC) U2.31(AVDD) U16.2(OUT) U16.4(OUT)
VCC3.3E: C14.2 C15.2 C28.2 C29.2 EARTHNET.4(TCT) EARTHNET.5(RCT) L1.1 R3.2 R4.2 R5.2 R6.2 U1.1(VDD2A) U1.19(VDD1A)
VCC5: C36.2 C40.2 C48.2 C56.1 C70.2 C74.1 C75.1 C78.2 C80.1 D5.2 K1.2(TAP1) M1.J1_58(VCC5) M1.J1_59(VCC5) M1.J1_60(VCC5) MOS1.2(S) R1.2 R55.2 TFTLCD.28(BL_VDD) U5.6(VCC) U8.3(VCC) U14.3(IN) U15.16(VCC) U16.3(IN) VOUT2.2 VOUT2.4 VOUT2.6
1WIRE_DQ: M1.J2_4(PB12) P3.13 R54.1 U9.13(INT) U10.2(DQ)
9D_INT: R50.1 U6.12(INT) U9.10(P5)
AP_INT: R45.2 U9.5(P1) U12.7(INT)
BEEP: R57.1 U9.4(P0)
BOOT0: M1.J1_31(BOOT0) R22.1 R68.2
BOOT1: M1.J1_55(PB2) P3.5 R23.2
CAN_RX: P10.1 U8.4(R)
CAN_TX: P10.2 U8.1(D)
CH340_D+: U15.5(D+) USB_232.3(D+)
CH340_D-: U15.6(D-) USB_232.2(D-)
DCMI_D0: M1.J2_16(PC6) P2.33 P7.8
DCMI_D1: M1.J2_17(PC7) P2.34 P7.9
DCMI_D2: M1.J2_18(PC8) P2.35 P7.10 R40.2 SD_CARD.7(DATA0)
DCMI_D3: M1.J2_19(PC9) P2.36 P7.11 R41.2 SD_CARD.8(DATA1)
DCMI_D4: M1.J1_39(PC11) P2.27 P7.12 R33.2 SD_CARD.1(CD/DATA3)
DCMI_D5: M1.J1_36(PD3) P2.24 P7.13
DCMI_D6: M1.J1_26(PB8) P2.16 P7.14
DCMI_D7: M1.J1_27(PB9) P2.17 P7.15
DCMI_HREF: M1.J2_3(PH8) P2.29 P7.5
DCMI_PCLK: M1.J1_47(PA6) P2.5 P7.16
DCMI_PWDN: P7.18 U9.6(P2)
DCMI_RESET: JTAG.5(TDI) M1.J1_41(PA15) P2.19 P7.7 R25.2
DCMI_SCL: JTAG.3(TRST) M1.J1_22(PB4) P2.12 P7.4 R24.2
DCMI_SDA: JTAG.13(TDO/SWO) M1.J1_21(PB3) P2.11 P7.6 R28.2
DCMI_VSYNC: M1.J1_25(PB7) P2.15 P7.3
DCMI_XCLK: M1.J2_20(PA8) P2.37 P7.17 R59.1
ETH_MDC: M1.J1_9(PC1) P3.42 U1.13(MDC)
ETH_MDIO: M1.J1_4(PA2) P8.3 R2.1
ETH_RESET: Q1.3(C) R44.1 U1.15(nRST)
EXIO: P3.2 R52.1 U9.9(P4)
FMC_A16_CLE: M1.J2_23(PD11) P2.40
FMC_A17_ALE: M1.J2_21(PD12) P2.38
FMC_A18: M1.J2_14(PD13) P3.21 TFTLCD.2(RS)
FMC_D0: M1.J2_45(PD14) P6.1 TFTLCD.6(D0)
FMC_D1: M1.J2_46(PD15) P6.2 TFTLCD.7(D1)
FMC_D2: M1.J2_47(PD0) P6.3 TFTLCD.8(D2)
FMC_D3: M1.J2_48(PD1) P6.4 TFTLCD.9(D3)
FMC_D4: M1.J2_49(PE7) P6.5 TFTLCD.10(D4)
FMC_D5: M1.J2_50(PE8) P6.6 TFTLCD.11(D5)
FMC_D6: M1.J2_51(PE9) P6.7 TFTLCD.12(D6)
FMC_D7: M1.J2_52(PE10) P6.8 TFTLCD.13(D7)
FMC_D8: M1.J2_53(PE11) P6.9 TFTLCD.14(D8)
FMC_D9: M1.J2_54(PE12) P6.10 TFTLCD.15(D9)
FMC_D10: M1.J2_55(PE13) P6.11 TFTLCD.16(D10)
FMC_D11: M1.J2_56(PE14) P6.12 TFTLCD.17(D11)
FMC_D12: M1.J2_57(PE15) P6.13 TFTLCD.18(D12)
FMC_D13: M1.J2_58(PD8) P6.14 TFTLCD.19(D13)
FMC_D14: M1.J2_59(PD9) P6.15 TFTLCD.20(D14)
FMC_D15: M1.J2_60(PD10) P6.16 TFTLCD.21(D15)
FMC_NBL0: M1.J2_43(PE0) P3.23
FMC_NBL1: M1.J2_44(PE1) P3.22
FMC_NE1: M1.J1_35(PD7) P2.23 TFTLCD.1(LCD_CS)
FMC_NOE: M1.J2_26(PD4) P2.43 TFTLCD.4(RD)
FMC_NWAIT: M1.J2_27(PD6) P2.44
FMC_NWE: M1.J2_22(PD5) P2.39 TFTLCD.3(WR/CLK)
GBC_KEY: M1.J1_15(PI11) P2.10 R30.1 U5.2(KEY)
GBC_LED: M1.J1_45(PA4) P3.7 P11.3 U5.1(LED)
GBC_RX: P9.6 U5.3(RXD)
GBC_TX: P9.5 U5.4(TXD)
IIC_SCL: M1.J1_8(PH4) P2.4 U2.16(SCLK) U6.23(SCL/SCLK) U9.14(SCL) U12.2(SCL)
IIC_SDA: M1.J1_7(PH5) P2.3 U2.17(SDIN) U6.24(SDA/SDI) U9.15(SDA) U12.8(SDA)
JTCK: JTAG.9(TCK/SWCLK) M1.J1_42(PA14) P2.21 R29.2
JTMS: JTAG.7(TMS/SWDIO) M1.J1_43(PA13) P2.20 R26.2
KEY0: KEY0.2 M1.J1_6(PH3) P2.2
KEY1: KEY1.2 M1.J1_5(PH2) P2.1
KEY2: KEY2.2 M1.J1_28(PC13) P2.18
LCD_B3: M1.J2_35(PG11) P3.31
LCD_B4: M1.J2_36(PI4) P3.30
LCD_B5: M1.J2_37(PI5) P3.29
LCD_B6: M1.J2_38(PI6) P3.28
LCD_B7: M1.J2_39(PI7) P3.27
LCD_BL: M1.J1_23(PB5) P2.13 TFTLCD.23(BL)
LCD_G2: M1.J2_30(PH13) P3.37
LCD_G3: M1.J2_29(PH14) P3.36
LCD_G4: M1.J2_28(PH15) P3.35
LCD_G5: M1.J2_34(PI0) P3.32
LCD_G6: M1.J2_33(PI1) P3.33
LCD_G7: M1.J2_32(PI2) P3.34
LCD_R3: M1.J2_10(PH9) P3.19
LCD_R4: M1.J2_11(PH10) P3.15
LCD_R5: M1.J2_12(PH11) P3.20
LCD_R6: M1.J2_24(PH12) P2.41
LCD_R7: M1.J2_15(PG6) P3.17
LED0: DS0.2(K) M1.J1_57(PB1) P3.3
LED1: DS1.2(K) M1.J1_56(PB0) P3.4
LINK_LED: EARTHNET.12(LED(Y)_A) R8.1 U1.3(LED1/REGOFF)
NRF_CE: M1.J2_25(PG12) P2.42 R58.2 U4.3(CE)
NRF_CS: M1.J1_34(PG10) P2.22 U4.4(CSN)
PA0: KEY_UP.2 M1.J2_42(PA0) P3.24
PA1: M1.J1_3(PA1) P3.41 U1.14(nINT/REFCLKO)
PA3: M1.J1_44(PA3) P8.4 R19.2
PA5: M1.J1_46(PA5) P3.6 P11.2
PA7: M1.J1_48(PA7) P3.40 U1.11(CSR_DV/MODE2)
PA9: M1.J1_51(PA9) P4.3
PA10: M1.J1_52(PA10) P4.1
PA11: M1.J1_53(PA11) P10.3
PA12: M1.J1_54(PA12) P10.4
PB6: M1.J1_24(PB6) P2.14
PB10: M1.J2_2(PB10) P9.4
PB11: M1.J2_1(PB11) P9.3 U1.16(TXEN)
PB13: M1.J2_5(PB13) P2.30 U4.5(SCK)
PB14: M1.J2_6(PB14) P2.31 U4.7(MISO)
PB15: M1.J2_7(PB15) P2.32 U4.6(MOSI)
PC4: M1.J1_49(PC4) P3.39 U1.8(RXD0/MODE0)
PC5: M1.J1_50(PC5) P3.38 U1.7(RXD1/MODE1)
PC10: M1.J1_40(PC10) P2.28 R31.2 SD_CARD.9(DATA2)
PC12: M1.J1_38(PC12) P2.26 SD_CARD.5(CLK)
PD2: M1.J1_37(PD2) P2.25 R36.2 SD_CARD.2(CMD)
PE2: M1.J1_20(PE2) P3.8 U2.11(MCLK)
PE3: M1.J1_19(PE3) P3.9 U2.9(ADCDAT)
PE4: M1.J1_18(PE4) P3.10 U2.7(LRC)
PE5: M1.J1_17(PE5) P3.11 U2.8(BCLK)
PE6: M1.J1_16(PE6) P3.12 U2.10(DACDAT)
PF6: M1.J1_14(PF6) P2.9
PF7: M1.J1_13(PF7) P2.8
PF8: M1.J1_12(PF8) P2.7
PF9: M1.J1_11(PF9) P2.6
PG3: M1.J2_13(PG3) P3.16 TFTLCD.29(MISO)
PG13: M1.J1_33(PG13) P3.44 U1.17(TXD0)
PG14: M1.J1_32(PG14) P3.43 U1.18(TXD1)
PH6: M1.J2_8(PH6) P3.18 TFTLCD.34(CLK)
PH7: M1.J2_9(PH7) P3.14 TFTLCD.31(T_PEN)
PI3: M1.J2_41(PI3) P3.25 TFTLCD.30(MOSI)
PI8: M1.J2_40(PI8) P3.26 TFTLCD.33(T_CS)
PWM_AUDIO: C20.1 C21.1 P1.2
RESET: C37.1 D7.1 JTAG.15(RESET#) M1.J1_10(RESET) R21.1 RESET.1 TFTLCD.5(RST)
RS485_RE: U7.2(RE) U7.3(DE) U9.11(P6)
RS485_RX: P8.5 U7.4(DI)
RS485_TX: P8.6 U7.1(RO)
RXD: P4.4 U15.3(RXD)
SPEED_LED: EARTHNET.9(LED(G)_A) R9.1 U1.2(LED2/nINTSEL)
TPAD: P11.1 R60.1 TPAD.1(TAPD)
TPRX+: C32.2 EARTHNET.3(RD+) R5.1 U1.23(RXP)
TPRX-: C33.2 EARTHNET.6(RD-) R6.1 U1.22(RXN)
TPTX+: C30.2 EARTHNET.1(TD+) R3.1 U1.21(TXP)
TPTX-: C31.2 EARTHNET.2(TD-) R4.1 U1.20(TXN)
TXD: P4.2 U15.2(TXD)
U2_RX: P8.1 U3.11(DIN1)
U2_TX: P8.2 U3.12(ROUT1)
U3_232RX: COM3.4 U3.8(RIN2)
U3_232TX: COM3.3 U3.7(DOUT2)
U3_RX: P9.2 U3.10(DIN2)
U3_TX: P9.1 U3.9(ROUT2)
USB_N: R47.2 USB_HOST.2(D-) USB_SLAVE.2(D-)
USB_P: R49.2 USB_HOST.3(D+) USB_SLAVE.3(D+)
USB_PWR: R51.2 R56.2 U9.7(P3)
VBTN: C67.1 C68.1(VCC) F1.2 K1.3(I/O1) L2.1 R64.1
VREF+: M1.J1_2(VREF+) P5.1
VUSB: F1.1 USB_232.1(VCC) USB_SLAVE.1(VCC)
NETBAT_1: BAT.1(VCC) D2.1
NETBEEP_1: BEEP.1(P) Q2.3(C)
NETBOOT_3: BOOT.3 R22.2
NETBOOT_4: BOOT.4 R23.1
NETC3_2: C3.2 C5.2 R1.1 U2.26(SPKVDD)
NETC4_1: C4.1(VCC) U2.29(ROUT1)
NETC4_2: C4.2(GND) PHONE.1(CHL)
NETC6_1: C6.1(VCC) U2.30(LOUT1)
NETC6_2: C6.2(GND) PHONE.2(CHR)
NETC7_2: C7.2 C8.2 R7.1 U2.13(DCVDD) U2.14(DBVDD)
NETC9_1: C9.1 LINE_IN.2(CHR)
NETC9_2: C9.2 U2.3(L2/GPIO2)
NETC10_1: C10.1 LINE_IN.1(CHL)
NETC10_2: C10.2 U2.6(R2/GPIO3)
NETC11_2: C11.2 C12.2 U1.6(VDDCR)
NETC16_1: C16.1 C18.1 C26.2 MIC.1(VCC) R13.2 R15.2
NETC16_2: C16.2 U2.1(LIP)
NETC17_1: C17.1 C19.1 MIC.2(GND) R12.2
NETC17_2: C17.2 U2.2(LIN)
NETC18_2: C18.2 U2.4(RIP)
NETC19_2: C19.2 U2.5(RIN)
NETC20_2: C20.2 U2.19(AUXL)
NETC21_2: C21.2 U2.20(AUXR)
NETC22_2: C22.2 R11.1 U1.4(XTAL2) Y1.1(OSC1)
NETC23_2: C23.2 R11.2 U1.5(XTAL1/CLKIN) Y1.2(OSC2)
NETC24_2: C24.2 U2.27(VMID)
NETC25_2: C25.2 R13.1 U2.32(MICBIAS)
NETC34_2: C34.2 R19.1 R20.2
NETC35_2: C35.2 P1.1 R20.1
NETC41_2: C41.2 P5.2 R27.1
NETC43_1: C43.1 U3.3(C1-)
NETC43_2: C43.2 U3.1(C1+)
NETC45_2: C45.2 U3.2(V+)
NETC46_1: C46.1 U3.5(C2-)
NETC46_2: C46.2 U3.4(C2+)
NETC47_2: C47.2 U3.6(V-)
NETC52_1: C52.1 C53.1 C54.1 R42.1 U6.1(RESV) U6.8(VDDIO) U6.13(VDD) U6.22(nCS)
NETC55_1: C55.1 U6.10(REGOUT)
NETC59_2: C59.2 MOS1.3(D) USB_HOST.1(VCC)
NETC60_1: C60.1 OPTICAL.1(OUT) R58.1
NETC66_1: C66.1 D3.2 L2.2 U13.6(SW)
NETC66_2: C66.2 U13.1(BST)
NETC72_2: C72.2 C73.2 D4.2 R63.1 U13.5(IN)
NETC76_2: C76.2 U15.4(V3)
NETC81_1: C81.1 U15.8(XO) Y2.2(OSC2)
NETC82_1: C82.1 U15.7(XI) Y2.1(OSC1)
NETCAN_1: CAN.1 R43.2 U8.7(CANH)
NETCAN_2: CAN.2 R43.1 U8.6(CANL)
NETCOM2_2: COM2.2 U3.14(DOUT1)
NETCOM2_3: COM2.3 U3.13(RIN1)
NETD4_1: D4.1 DC_IN.1
NETD7_2: D7.2 Q4.3(C) R65.2
NETDS0_1: DS0.1(A) R35.2
NETDS1_1: DS1.1(A) R38.2
NETEARTHNET_10: EARTHNET.10(LED(G)_K) R17.2
NETEARTHNET_11: EARTHNET.11(LED(Y)_K) R18.2
NETMOS1_1: MOS1.1(G) R53.2
NETP10_5: P10.5 R47.1
NETP10_6: P10.6 R49.1
NETPWR_1: PWR.1(A) R39.2
NETQ1_1: Q1.1(B) R46.2
NETQ2_1: Q2.1(B) R57.2
NETQ3_1: Q3.1(B) R56.1
NETQ3_3: Q3.3(C) R53.1 R55.1
NETQ4_1: Q4.1(B) R66.2
NETQ4_2: Q4.2(E) R67.1 U15.14(RTS#)
NETQ5_1: Q5.1(B) R67.2
NETQ5_3: Q5.3(C) R68.1
NETR2_2: R2.2 U1.12(MDIO)
NETR10_2: R10.2 U1.24(RBIAS)
NETR14_1: R14.1 U2.18(MODE)
NETR30_2: R30.2 U4.8(IRQ)
NETR32_1: R32.1 R37.2 RS485.2 U7.7(B)
NETR34_2: R34.2 R37.1 RS485.1 U7.6(A)
NETR46_1: R46.1 R48.1 U9.12(P7)
NETR59_2: R59.2 R61.1 U11.1(DATA)
NETR62_1: R62.1 R64.2 U13.3(FB)
NETR63_2: R63.2 U13.4(EN)
NETR66_1: R66.1 U15.13(DTR#)
NETSP+_1: SP+.1 U2.25(LOUT2)
NETSP-_1: SP-.1 U2.23(ROUT2)
NETU12_5: U12.5(LEDC) U12.6(LDR)

Not connected (* = marked no-connect by the designer): COM2 1 4 6 7 8 9; COM3 2 5 6 7 8 9; EARTHNET 7(NC); JTAG 11(NC) 17(NC) 19(NC); K1 1(I/O1) 4(I/O2) 5(TAP2) 6(I/O2); SD_CARD 10(CD) 11(GND) 12(WP); TFTLCD 32(MO); U1 10(RXER/PHYAD0); U2 15(CSB/GPIO1) 21(OUT4) 22(OUT3); U6 2(NC) 3(NC) 4(NC) 5(NC) 6(NC) 7(AUX_CL) 14(NC) 15(NC) 16(NC) 17(NC) 19(RESV) 21(AUX_DA); U8 5(Vref); U15 9(CTS#) 10(DSR#) 11(RI#) 12(DCD#) 15(R232); USB_232 4(NC); USB_SLAVE 4(NC)

## Notes on the sheets
sheet 1
- I2S音频处理电路单元
- DAC/PWM_AUDIO电路单元
- 网络电路单元
sheet 2
- 复位
- 后备电源
- 底板与核心板接口
- USB转口串口
- 启动BOOT选择
- 扩展IO口
- JTAG调试接口
- 参考电压选择
- TFT屏接口
sheet 3
- RS232接口
- 无线模块接口
- 摄像头接口
- ATK模块接口
- CAN/USB接口
- LED灯
- 九轴陀螺仪
- SD卡
- 按键
- 温度湿度
- 光纤
- IIC扩展并口
- 红外遥控接收头
- 多功能选择口
- 触模按键
- 光电检测
- 蜂鸣器
sheet 4
- 开关及3.3V供电
- 外部电源输入
- 对外输出电源
- 模拟3.3V供电
- USB转串口/程序下载电路
